# EAGLE design littlelights (EAGLE 7.3.0)
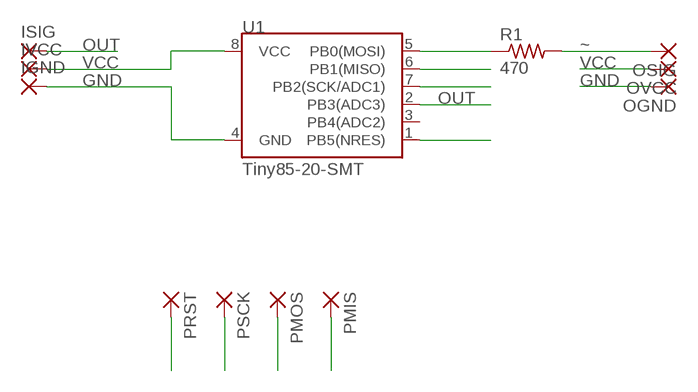
[diagram p0: schematic, sheet 1]

## Parts
IGND  SMD2  [SMD1,27-2,54]
ISIG  SMD2  [SMD1,27-2,54]
IVCC  SMD2  [SMD1,27-2,54]
OGND  SMD2  [SMD1,27-2,54]
OSIG  SMD2  [SMD1,27-2,54]
OVCC  SMD2  [SMD1,27-2,54]
PMIS  SMD2  [SMD1,27-2,54]
PMOS  SMD2  [SMD1,27-2,54]
PRST  SMD2  [SMD1,27-2,54]
PSCK  SMD2  [SMD1,27-2,54]
R1  470  R-US_R0603  [R0603]
U1  Tiny85-20-SMT  ATTINY45TINY85-20-SMT  [SO08-EIAJ]

## Nets
GND: IGND.1(P) OGND.1(P) U1.4(GND)
MISO: PMIS.1(P) U1.6(PB1(MISO))
MOSI: PMOS.1(P) R1.1 U1.5(PB0(MOSI))
OUT: ISIG.1(P) U1.2(PB3(ADC3))
RESET: PRST.1(P) U1.1(PB5(NRES))
SCK: PSCK.1(P) U1.7(PB2(SCK/ADC1))
VCC: IVCC.1(P) OVCC.1(P) U1.8(VCC)
~: OSIG.1(P) R1.2
Unconnected: U1.3(PB4(ADC2))

## Library data of the parts
IGND ISIG IVCC OGND OSIG OVCC PMIS PMOS PRST PSCK = wirepad:SMD2: SMD PAD
R1 = resistor:R-US_: RESISTOR, American symbol; DIGIKEY: MCT0603-470-CFCT-ND
U1 = SparkFun-DigitalIC:ATTINY45: Atmel 8-pin 2/4/8kB flash uC; DIGIKEY: ATTINY85-20SHRCT-ND; PROD_ID: IC-09092

## Board
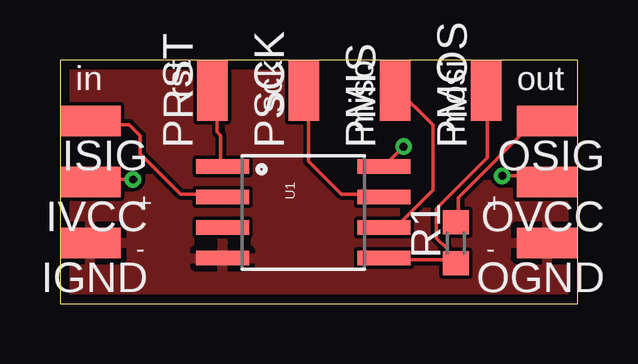
[diagram p1: board, top side]
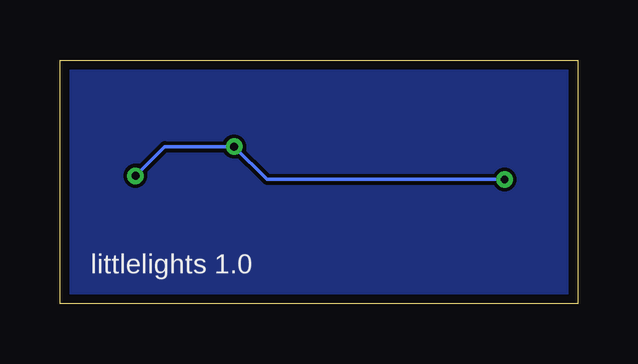
[diagram p2: board, bottom side, seen from below]

Size 21.59 x 10.15 mm. Coordinates in mm from the lower left corner, seen from the top.
Outline: 0,0 21.59,0 21.59,10.15 0,10.15 0,0
Copper layers (1*16): Top 0.0356mm / dielectric 1.5011mm / Bottom 0.0356mm
Design rules "oshpark-2layer": minimum track width 6mil, minimum drill 13mil, track to track 6mil, track to pad 6mil, pad to pad 6mil, via to via 6mil, smd to smd 6mil, copper to edge 15mil, drill to drill 6mil, minimum pad ring 7mil, minimum via ring 7mil, stop-mask expansion 4mil, vias tented up to drill 0mil, thermal gap 10mil

### Footprints (pad centres in the part's own frame; a part is rotated, then mirrored left to right if it is on the bottom)
SMD1,27-2,54 = smd 1.27 x 2.54: 1 0,0
R0603 = smd 1 x 1.1: 1 -0.85,0; 2 0.85,0
SO08-EIAJ = smd 0.61 x 2.21: 1 -1.905,-3.378; 2 -0.635,-3.378; 3 0.635,-3.378; 4 1.905,-3.378; 5 1.905,3.353; 6 0.635,3.353; 7 -0.635,3.353; 8 -1.905,3.353

### Placement (x,y rotation side)
IGND  1.27,2.54 90 top
ISIG  1.27,7.62 90 top
IVCC  1.27,5.08 90 top
OGND  20.32,2.54 90 top
OSIG  20.32,7.62 90 top
OVCC  20.32,5.08 90 top
PMIS  13.97,8.89 0 top
PMOS  17.78,8.89 0 top
PRST  6.35,8.89 0 top
PSCK  10.16,8.89 0 top
R1  16.51,2.54 90 top
U1  10.16,3.81 270 top

### Tracks (layer width: path | path; a pad name or v marks a point on that pad's centre or on a via)
GND
  pour Bottom: 0,0 21.59,0 21.59,10.16 0,10.16
  pour Top: 0,10.16 0,0 21.59,0 21.59,10.16
MISO
  Top 0.152: U1.6 13.56,3.2 14.02,3.2 15.54,4.72 15.54,7.47 14.02,8.99 PMIS.1
MOSI
  Top 0.152: 16.15,1.83 13.56,1.83 U1.5 | 16.15,1.83 16.46,1.83 R1.1 16.15,1.83 | 16.15,1.83 16.15,2.29 15.7,2.74 15.7,3.96 17.83,6.1 17.83,8.84 PMOS.1
OUT
  Top 0.152: U1.2 6.71,4.57 5.03,4.57 3.35,6.25 3.35,7.01 2.9,7.47 1.52,7.47 1.37,7.62 ISIG.1
RESET
  Top 0.152: PRST.1 6.55,8.69 6.55,7.16 6.71,7.01 6.71,5.79 U1.1
SCK
  Top 0.152: PSCK.1 10.36,8.69 10.36,5.94 11.73,4.57 13.41,4.57 U1.7
VCC  (via drill 0.33)
  Top 0.152: v14.33,6.55 13.56,5.79 U1.8 | v18.44,5.33 20.12,5.33 20.27,5.18 OVCC.1 | v3.05,5.18 1.37,5.18 IVCC.1
  Bottom 0.152: v18.44,5.33 17.22,6.55 v14.33,6.55 12.95,5.18 v3.05,5.18
~
  Top 0.152: OSIG.1 19.81,7.62 16.61,4.42 16.61,3.5 R1.2

### Text on the board
tPlace: rst | sck | miso | mosi | in | out | + | + | - | -
bPlace: littlelights 1.0